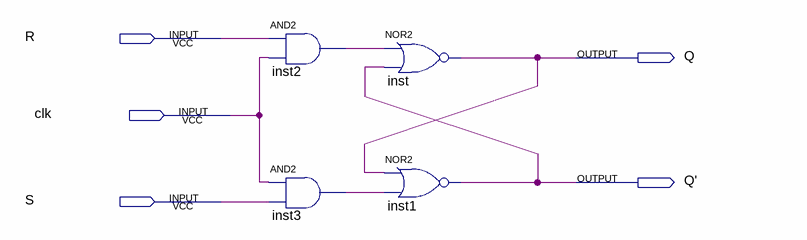
[diagram p0: schematic sheet]
// Quartus schematic aula2.bdf as structural Verilog: 4 symbols, 5 pins
module aula2 (
  input  R,
  input  clk,
  input  S,
  output Q,
  output \Q' 
);

  wire inst2_out, inst3_out;

  and inst2 (inst2_out, R, clk);
  and inst3 (inst3_out, clk, S);
  nor inst (Q, inst2_out, \Q' );
  nor inst1 (\Q' , Q, inst3_out);
endmodule
